# EAGLE design power_prong (EAGLE 6.2)
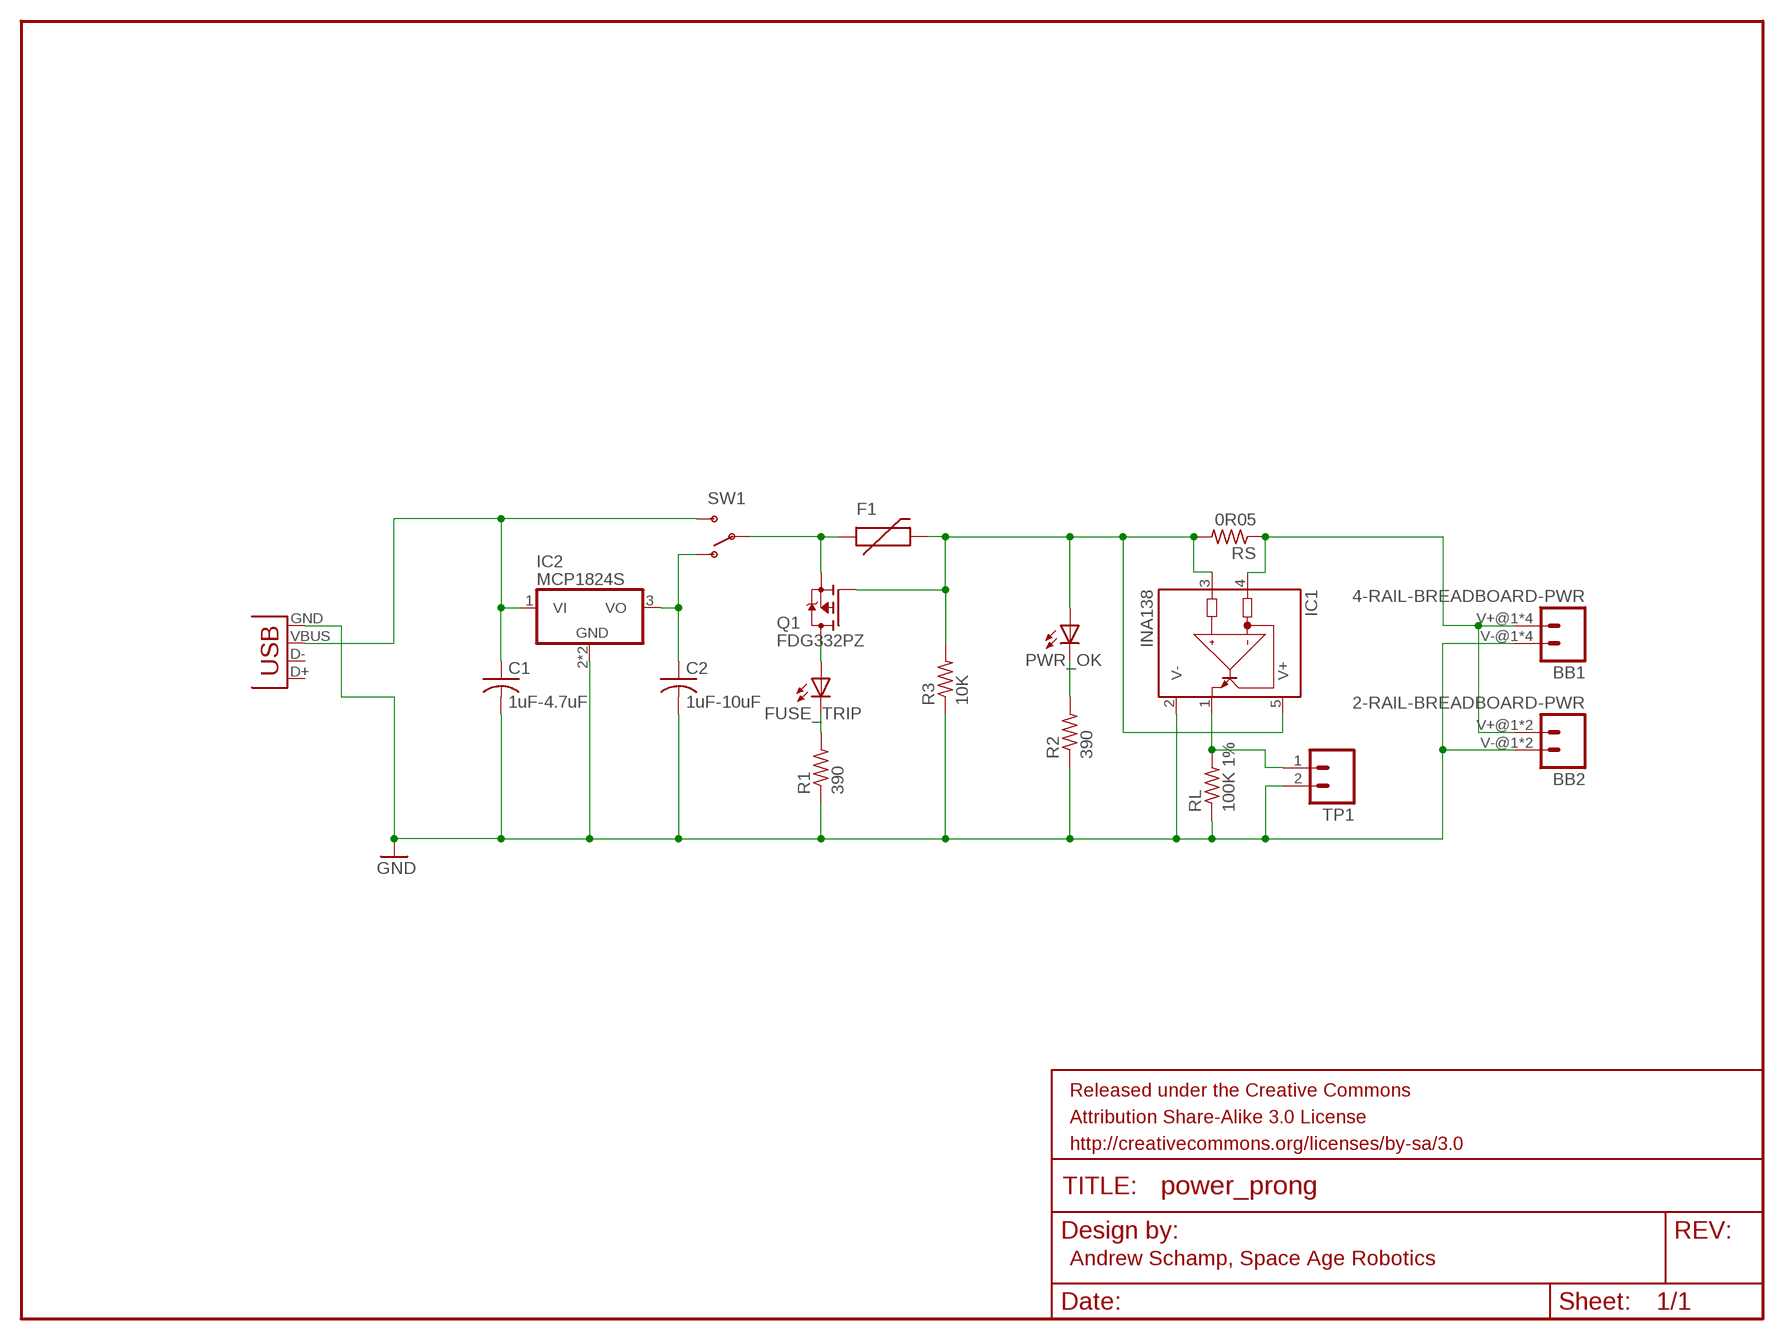
[diagram p0: schematic, sheet 1]

## Parts
BB1  4-RAIL-BREADBOARD-PWR  [4-RAIL-BREADBOARD_X2]
BB2  2-RAIL-BREADBOARD-PWR  [2-RAIL-BREADBOARD]
C1  1uF-4.7uF  C-USC0805  [C0805]
C2  1uF-10uF  C-USC0805  [C0805]
F1  PTCSMD  [PTC-1206]
FUSE_TRIP  LEDCHIP-LED0805  [CHIP-LED0805]
IC1  INA138  [SOT23-5]
IC2  MCP1824S  [SOT223]
PWR_OK  LEDCHIP-LED0805  [CHIP-LED0805]
Q1  FDG332PZ  [SC70-6L]
R1  390  R-US_R0603  [R0603]
R2  390  R-US_R0603  [R0603]
R3  10K  R-US_R0603  [R0603]
RL  100K 1%  R-US_R0805  [R0805]
RS  0R05  R-US_R0805  [R0805]
SW1  SWITCH-SPDTMSH12204  [MSH12204]
TP1  M023.5MM-NO_SILK  [SCREWTERMINAL-3.5MM-2-NS]
X1  USBSMD  [USB-MINIB]

## Nets
GND: BB1.V-@1 BB1.V-@2 BB1.V-@3 BB1.V-@4 BB2.V-@1 BB2.V-@2 C1.2 C2.2 IC1.2(V-) IC2.2(GND) IC2.4(GND) R1.1 R2.1 R3.1 RL.1 TP1.2 X1.GND
N$1: F1.1 Q1.4(S) SW1.2(P)
N$2: C1.1 IC2.1(VI) SW1.3(S) X1.VBUS
N$3: FUSE_TRIP.A Q1.1(D) Q1.2(D) Q1.5(D) Q1.6(D)
N$4: IC1.1(OUT) RL.2 TP1.1
N$5: F1.2 IC1.3(IN+) IC1.5(V+) PWR_OK.A Q1.3(G) R3.2 RS.2
N$6: PWR_OK.C R2.2
N$10: FUSE_TRIP.C R1.2
N$13: C2.1 IC2.3(VO) SW1.1(O)
VOUT: BB1.V+@1 BB1.V+@2 BB1.V+@3 BB1.V+@4 BB2.V+@1 BB2.V+@2 IC1.4(IN-) RS.1
Unconnected: X1.D+ X1.D-

## Notes on the sheet
- Andrew Schamp, Space Age Robotics

## Library data of the parts
BB1 = space_age_robotics:4-RAIL-BREADBOARD-PWR
BB2 = space_age_robotics:2-RAIL-BREADBOARD-PWR
C1 C2 = rcl:C-US: CAPACITOR, American symbol
F1 = SparkFun-PowerIC:PTC: Resettable Fuse PTC Resettable Fuse. Spark Fun Electronics SKU : COM-08357
FUSE_TRIP PWR_OK = led:LED: LED OSRAM: - CHIPLED LG R971, LG N971, LY N971, LG Q971, LY Q971, LO R971, LY R971 LH N974, LH R974 LS Q976, LO Q976, LY Q976 LO Q996 - Hyper CHIPLED LW Q18S LB Q993, LB Q99A, LB R99A - SideLED LS A670, LO A670, LY A670, LG A670, LP A670 LB A673, LV A673, LT A673, LW A673 LH A674 LY A675 LS A676, LA A676, LO A676, LY A676, LW A676 LS A679, LY A679, LG A679 - Hyper Micro SIDELED® LS Y876, LA Y876, LO Y876, LY Y876 LT Y87S - SmartLED LW L88C, LW L88S LB L89C, LB L89S, LG L890 LS L89K, LO L89K, LY L89K LS L896, LA L896, LO L896, LY L896 - TOPLED LS T670, LO T670, LY T670, LG T670, LP T670 LSG T670, LSP T670, LSY T670, LOP T670, LYG T670 LG T671, LOG T671, LSG T671 LB T673, LV T673, LT T673, LW T673 LH T674 LS T676, LA T676, LO T676, LY T676, LB T676, LH T676, LSB T676, LW T676 LB T67C, LV T67C, LT T67C, LS T67K, LO T67K, LY T67K, LW E67C LS E67B, LA E67B, LO E67B, LY E67B, LB E67C, LV E67C, LT E67C LW T67C LS T679, LY T679, LG T679 LS T770, LO T770, LY T770, LG T770, LP T770 LB T773, LV T773, LT T773, LW T773 LH T774 LS E675, LA E675, LY E675, LS T675 LS T776, LA T776, LO T776, LY T776, LB T776 LHGB T686 LT T68C, LB T68C - Hyper Mini TOPLED® LB M676 - Mini TOPLED Santana® LG M470 LS M47K, LO M47K, LY M47K Source: http://www.osram.convergy.de LUXEON: - LUMILED® LXK2-PW12-R00, LXK2-PW12-S00, LXK2-PW14-U00, LXK2-PW14-V00 LXK2-PM12-R00, LXK2-PM12-S00, LXK2-PM14-U00 LXK2-PE12-Q00, LXK2-PE12-R00, LXK2-PE12-S00, LXK2-PE14-T00, LXK2-PE14-U00 LXK2-PB12-K00, LXK2-PB12-L00, LXK2-PB12-M00, LXK2-PB14-N00, LXK2-PB14-P00, LXK2-PB14-Q00 LXK2-PR12-L00, LXK2-PR12-M00, LXK2-PR14-Q00, LXK2-PR14-R00 LXK2-PD12-Q00, LXK2-PD12-R00, LXK2-PD12-S00 LXK2-PH12-R00, LXK2-PH12-S00 LXK2-PL12-P00, LXK2-PL12-Q00, LXK2-PL12-R00 Source: www.luxeon.com KINGBRIGHT: KA-3528ASYC Source: www.kingbright.com
IC1 = burr-brown:INA138: High-Side Measurement Current Shunt Monitor; MF: TEXAS INSTRUMENTS; MPN: INA138NA/250; OC_FARNELL: 1564888; OC_NEWARK: 80K5906
IC2 = space_age_robotics:MCP1824: 300mA, 6V LDO Regulator
Q1 = space_age_robotics:FDG332PZ
R1-R3 RL RS = resistor:R-US_: RESISTOR, American symbol
SW1 = space_age_robotics:SWITCH-SPDT: SPST Switch Simple slide switch. Spark Fun Electronics SKU : COM-00102
TP1 = SparkFun-Connectors:M02: Header 2 Standard 2-pin 0.1" header. Use with straight break away headers (SKU : PRT-00116), right angle break away headers (PRT-00553), swiss pins (PRT-00743), machine pins (PRT-00117), and female headers (PRT-00115). Molex polarized connector foot print use with SKU : PRT-08233 with associated crimp pins and housings.
X1 = SparkFun-Connectors:USB: USB Connectors USB-B-PTH is fully proven SKU : PRT-00139 USB-miniB is fully proven SKU : PRT-00587 USB-A-PCB is untested. USB-A-H is throughly reviewed, but untested. Spark Fun Electronics SKU : PRT-00437 USB-B-SMT is throughly reviewed, but untested. Needs silkscreen touching up. USB-A-S has not been used/tested USB-MB-H has not been used/tested

## Board
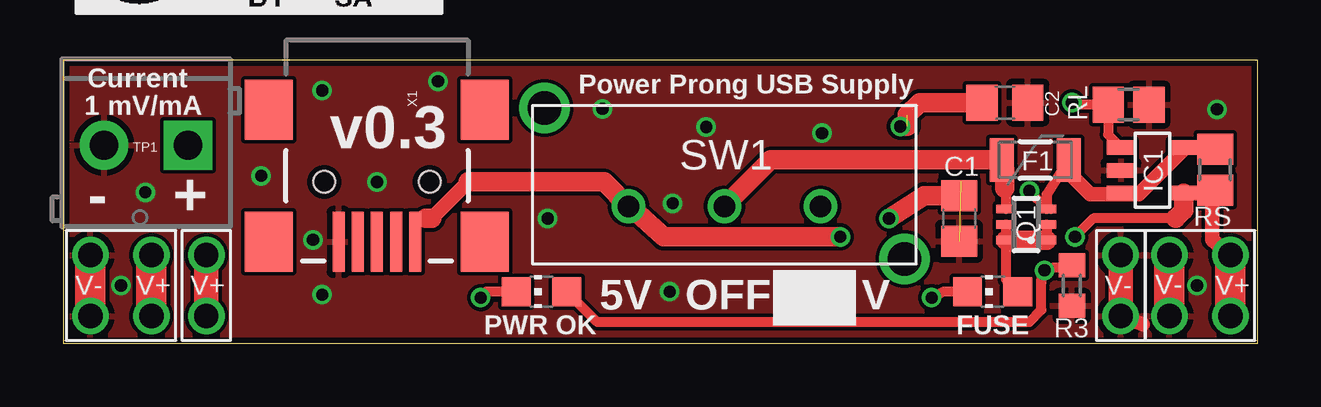
[diagram p1: board, top side]
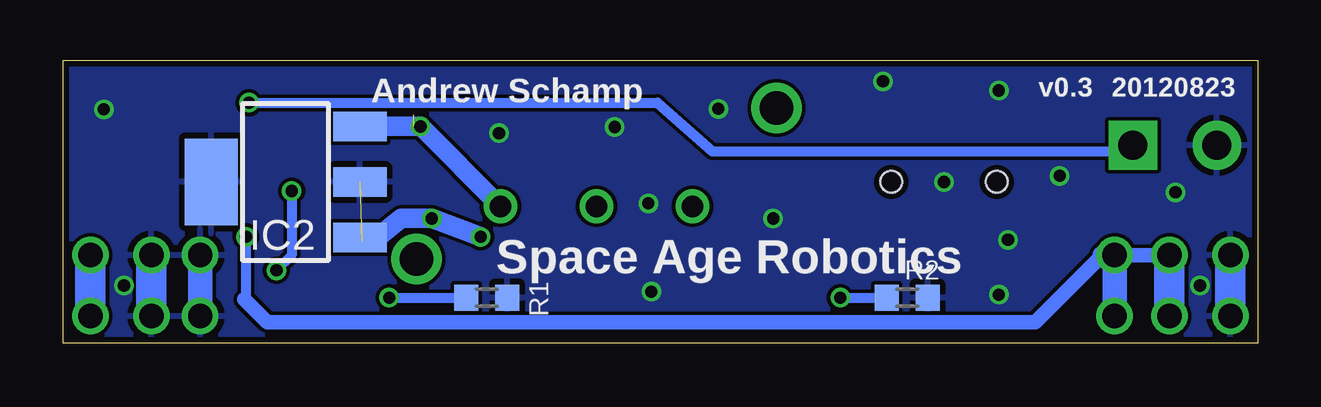
[diagram p2: board, bottom side, seen from below]

Size 49.78 x 11.81 mm. Coordinates in mm from the lower left corner, seen from the top.
Outline: 0,0 49.78,0 49.78,11.81 0,11.8 0,0
Copper layers (1*16): Top 0.035mm / dielectric 1.5mm / Bottom 0.035mm
Design rules: minimum track width 6mil, minimum drill 12mil, track to track 6mil, track to pad 6mil, pad to pad 6mil, via to via 6mil, smd to smd 0mil, copper to edge 10mil, drill to drill 10mil, minimum pad ring 10mil, minimum via ring 6mil, stop-mask expansion 2mil, vias tented up to drill 100mil, thermal gap 10mil

### Footprints (pad centres in the part's own frame; a part is rotated, then mirrored left to right if it is on the bottom)
4-RAIL-BREADBOARD_X2 = drill 1.016: V+@1 46.228,1.27; V+@2 46.228,-1.27; V+@3 1.27,1.27; V+@4 1.27,-1.27; V-@1 43.688,1.27; V-@2 43.688,-1.27; V-@3 -1.27,1.27; V-@4 -1.27,-1.27
2-RAIL-BREADBOARD = drill 1.016: V+@1 0,1.27; V+@2 0,-1.27; V-@1 38.1,1.27; V-@2 38.1,-1.27
C0805 = smd 1.3 x 1.5: 1 -0.95,0; 2 0.95,0
PTC-1206 = smd 1 x 1.8: 1 -1.4,0; 2 1.4,0
CHIP-LED0805 = smd 1.2 x 1.2: A 0,-1.05; C 0,1.05
SOT23-5 = smd 0.6 x 1.2: 1 -0.95,-1.306; 2 0,-1.306; 3 0.95,-1.306; 4 0.95,1.306; 5 -0.95,1.306
SOT223 = smd 1.219 x 2.235: 1 -2.311,-3.099; 2 0,-3.099; 3 2.311,-3.099 | smd 3.6 x 2.2: 4 0,3.099
SC70-6L = smd 0.35 x 0.8: 1 -0.65,-0.85; 2 0,-0.85; 3 0.65,-0.85; 4 0.65,0.85; 5 0,0.85; 6 -0.65,0.85
R0603 = smd 1 x 1.1: 1 -0.85,0; 2 0.85,0
R0805 = smd 1.3 x 1.5: 1 -0.85,0; 2 0.85,0
MSH12204 = drill 0.9: 1 -4,0; 2 0,0; 3 4,0 | drill 1.4: NC@1 -7.5,2.2; NC@2 7.5,-4.1
SCREWTERMINAL-3.5MM-2-NS = drill 1.2 pad 2.032 square: 1 0,0 | drill 1.2 pad 2.032: 2 3.5,0
USB-MINIB = smd 2.5 x 0.5: D+ 2.5,0; D- 2.5,0.8; GND 2.5,-1.6; ID 2.5,-0.8; VBUS 2.5,1.6 | smd 2.5 x 2: MTN1 -3,4.5; MTN2 2.5,4.5; MTN3 -3,-4.5; MTN4 2.5,-4.5 | hole 0.9: 0,2.2; 0,-2.2

### Placement (x,y rotation side)
BB1  2.41,2.41 0 top
BB2  5.97,2.41 0 top
C1  37.34,5.21 270 top
C2  39.24,10.03 0 top
F1  40.51,7.65 0 top
FUSE_TRIP  38.73,2.16 90 top
IC1  45.39,7.21 270 top
IC2  40.51,6.73 90 bottom
LOGO1  LOGO_CC-BY-SA  [CC-BY-SA]  0.51,13.72 0 top
PWR_OK  19.94,2.16 90 top
Q1  40.13,4.95 90 top
R1  32.13,1.91 180 bottom
R2  14.61,1.91 180 bottom
R3  42.04,2.41 90 top
RL  44.4,9.96 180 top
RS  48.01,7.24 90 top
SW1  27.56,5.71 180 top
TP1  5.21,8.26 180 top
X1  13.08,6.73 270 top

### Tracks (layer width: path | path; a pad name or v marks a point on that pad's centre or on a via)
GND  (via drill 0.51)  (1 unrouted)
  Top 0.61: BB2.V-@2 45,0.8
  other vias: 26.8,9.02 22.48,9.78 15.62,10.92 13.08,6.73 10.79,10.54 8.26,6.98 10.41,4.32 20.19,5.21 2.41,2.41 31.62,8.76 48.08,9.75 3.43,6.3 10.79,2.03 25.27,2.16 25.4,5.84 47.24,2.41
  pour Bottom: -1.27,-1.14 -1.27,28.07 54.61,28.07 54.61,-1.14
  pour Top: -2.54,-2.41 -2.54,29.34 55.88,29.34 55.88,-2.41
N$1
  Top 0.406: 39.24,6.48 39.28,6.44 Q1.4
  Top 0.813: SW1.2 29.49,7.64 F1.1 39.24,7.27 39.24,6.48
N$2  (via drill 0.51)
  Top 0.406: X1.VBUS 14.68,4.95 14.94,5.21 15.11,5.21
  Top 0.61: 15.37,5.21 16.89,6.73
  Top 0.813: 16.89,6.73 22.54,6.73 SW1.3 23.56,5.78 25.02,4.44 v32.38,4.44 | 15.37,5.21 15.11,5.21 | C1.1 35.88,6.16 v34.42,5.21
  Bottom 0.813: 37.24,4.42 IC2.1 37.16,4.24 36.91,4.24 35.69,5.21 v34.42,5.21 v32.38,4.44
N$3
  Top 0.406: Q1.5 Q1.6 39.28,2.66 FUSE_TRIP.A | Q1.2 Q1.1
  Top 0.813: Q1.6 Q1.1
N$4  (via drill 0.51)
  Top 0.406: IC1.1 43.55,8.7 RL.2 42.22,9.96 v42.04,10.03
  Bottom 0.406: v42.04,10.03 25.02,10.03 22.73,8 5.46,8 TP1.1
N$5  (via drill 0.51)
  Top 0.406: F1.2 40.98,6.21 Q1.3 41.01,5.6 | PWR_OK.A 22.26,0.89 40.26,0.89 40.77,1.4 40.77,2.54 40.77,2.67 | 40.77,2.67 v40.89,3.05 | v40.89,3.05 41.27,3.17 41.95,3.17 R3.2 | 41.16,5.6 41.01,5.6 | 41.01,5.6 v40.26,6.35 | v40.89,3.05 40.77,2.92 40.77,2.67
  Top 0.61: F1.2 41.91,7.11 42.8,6.22 44.04,6.22 IC1.3 44.12,6.22 44.83,6.22 46.7,8.09 IC1.5 47.93,8.16 RS.2
  Bottom 0.406: v40.26,6.35 40.26,3.68 v40.89,3.05
N$6  (via drill 0.51)
  Top 0.406: PWR_OK.C 17.65,2.16 v17.4,1.91
  Bottom 0.406: v17.4,1.91 R2.2
N$10  (via drill 0.51)
  Top 0.406: FUSE_TRIP.C 36.7,2.16 v36.2,1.91
  Bottom 0.406: v36.2,1.91 R1.2
N$13  (via drill 0.51)  (1 unrouted)
  Top 0.813: C2.1 35.69,10.03 35.18,9.53 | v34.89,9.04 35.18,9.04
  Bottom 0.813: SW1.1 v34.89,9.04 IC2.3
VOUT  (via drill 0.51)
  Top 0.406: 46.35,5.21 42.93,5.21 v42.16,4.44
  Top 0.61: RS.1 47.88,6.26 IC1.4 47.84,6.26 47.88,6.22 47.88,4.32 BB1.V+@1
  Top 0.813: IC1.4 46.7,5.55 46.35,5.21
  Bottom 0.406: v42.16,4.44 42.16,1.91 42.23,1.84
  Bottom 0.61: BB2.V+@1 BB1.V+@3 | 42.23,1.84 41.27,0.89 9.27,0.89 6.48,3.68
  Bottom 0.813: BB2.V+@1 6.48,3.68

### Text on the board
tPlace: Current | v0.3 | 1 mV/mA | - | + | 5V | OFF | V | PWR OK | FUSE
bPlace: 20120823 | v0.3 | Andrew Schamp | Space Age Robotics
tNames: Power Prong USB Supply
bDocu: USB Power Suppy | Power Prong | CC-BY-SA